# Altium project LED_Cube.PrjPcb
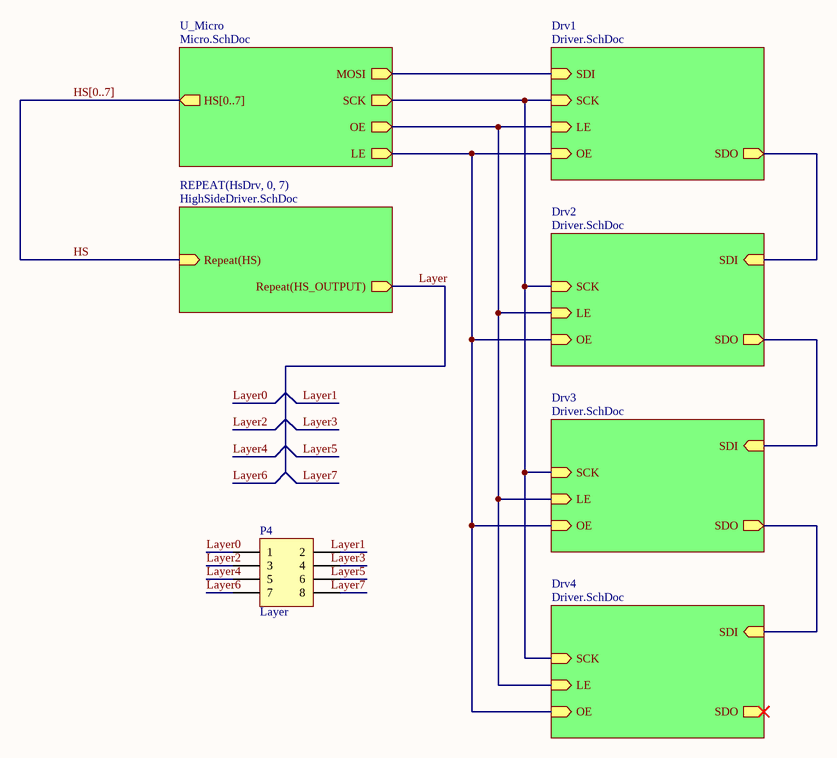
[diagram p0: Main.SchDoc]
4 sheets, 84 parts. Net scope: hierarchical (ports join the sheet entries above them; power ports are global).
Board file: LED_Cube.PcbDoc
Sheets:
  Main.SchDoc
    U_Micro = Micro.SchDoc
    Drv3 = Driver.SchDoc
    Drv2 = Driver.SchDoc
    Drv1 = Driver.SchDoc
    Drv4 = Driver.SchDoc
    HsDrv0 = HighSideDriver.SchDoc
    HsDrv1 = HighSideDriver.SchDoc
    HsDrv2 = HighSideDriver.SchDoc
    HsDrv3 = HighSideDriver.SchDoc
    HsDrv4 = HighSideDriver.SchDoc
    HsDrv5 = HighSideDriver.SchDoc
    HsDrv6 = HighSideDriver.SchDoc
    HsDrv7 = HighSideDriver.SchDoc

## Sheet Main.SchDoc
size A4

### Parts
(Parts that share a designator on the sheet are numbered #1, #2 ... from top to bottom, then left to right.)
P4#1  Layer  [HDR2X4H]

### Sub-sheets
Drv1 = Driver.SchDoc: SCK (in), SDI (in), SDO (out), LE (in), OE (in)
Drv2 = Driver.SchDoc: SCK (in), SDI (in), SDO (out), LE (in), OE (in)
Drv3 = Driver.SchDoc: SCK (in), SDI (in), SDO (out), LE (in), OE (in)
Drv4 = Driver.SchDoc: SCK (in), SDI (in), SDO (out), LE (in), OE (in)
REPEAT(HsDrv, 0, 7) = HighSideDriver.SchDoc: Repeat(HS_OUTPUT) (out), Repeat(HS) (in)
U_Micro = Micro.SchDoc: SCK (out), MOSI (out), OE (out), LE (out), HS[0..7] (out)

### Nets
Layer0: P4#1.1
Layer1: P4#1.2
Layer2: P4#1.3
Layer3: P4#1.4
Layer4: P4#1.5
Layer5: P4#1.6
Layer6: P4#1.7
Layer7: P4#1.8
NetU1#1_10: sheet U_Micro/LE, sheet Drv3/OE, sheet Drv2/OE, sheet Drv1/OE, sheet Drv4/OE
NetU1#1_11: sheet U_Micro/OE, sheet Drv3/LE, sheet Drv2/LE, sheet Drv1/LE, sheet Drv4/LE
NetU1#1_15: sheet U_Micro/SCK, sheet Drv3/SCK, sheet Drv2/SCK, sheet Drv1/SCK, sheet Drv4/SCK
NetU1#1_17: sheet U_Micro/MOSI, sheet Drv1/SDI
NetU1#2_22: sheet Drv2/SDI, sheet Drv1/SDO
NetU2#2_22: sheet Drv3/SDI, sheet Drv2/SDO
NetU3_22: sheet Drv3/SDO, sheet Drv4/SDI

### Buses and harness runs
bus HS[0..7] = sheet U_Micro/HS[0..7]

### Library data of the parts
P4#1 = Header 4X2H: Header, 4-Pin, Dual row, Right Angle; LatestRevisionDate: 17-Jul-2002; LatestRevisionNote: Re-released for DXP Platform.; Publisher: Altium Limited

## Sheet Micro.SchDoc
size A4
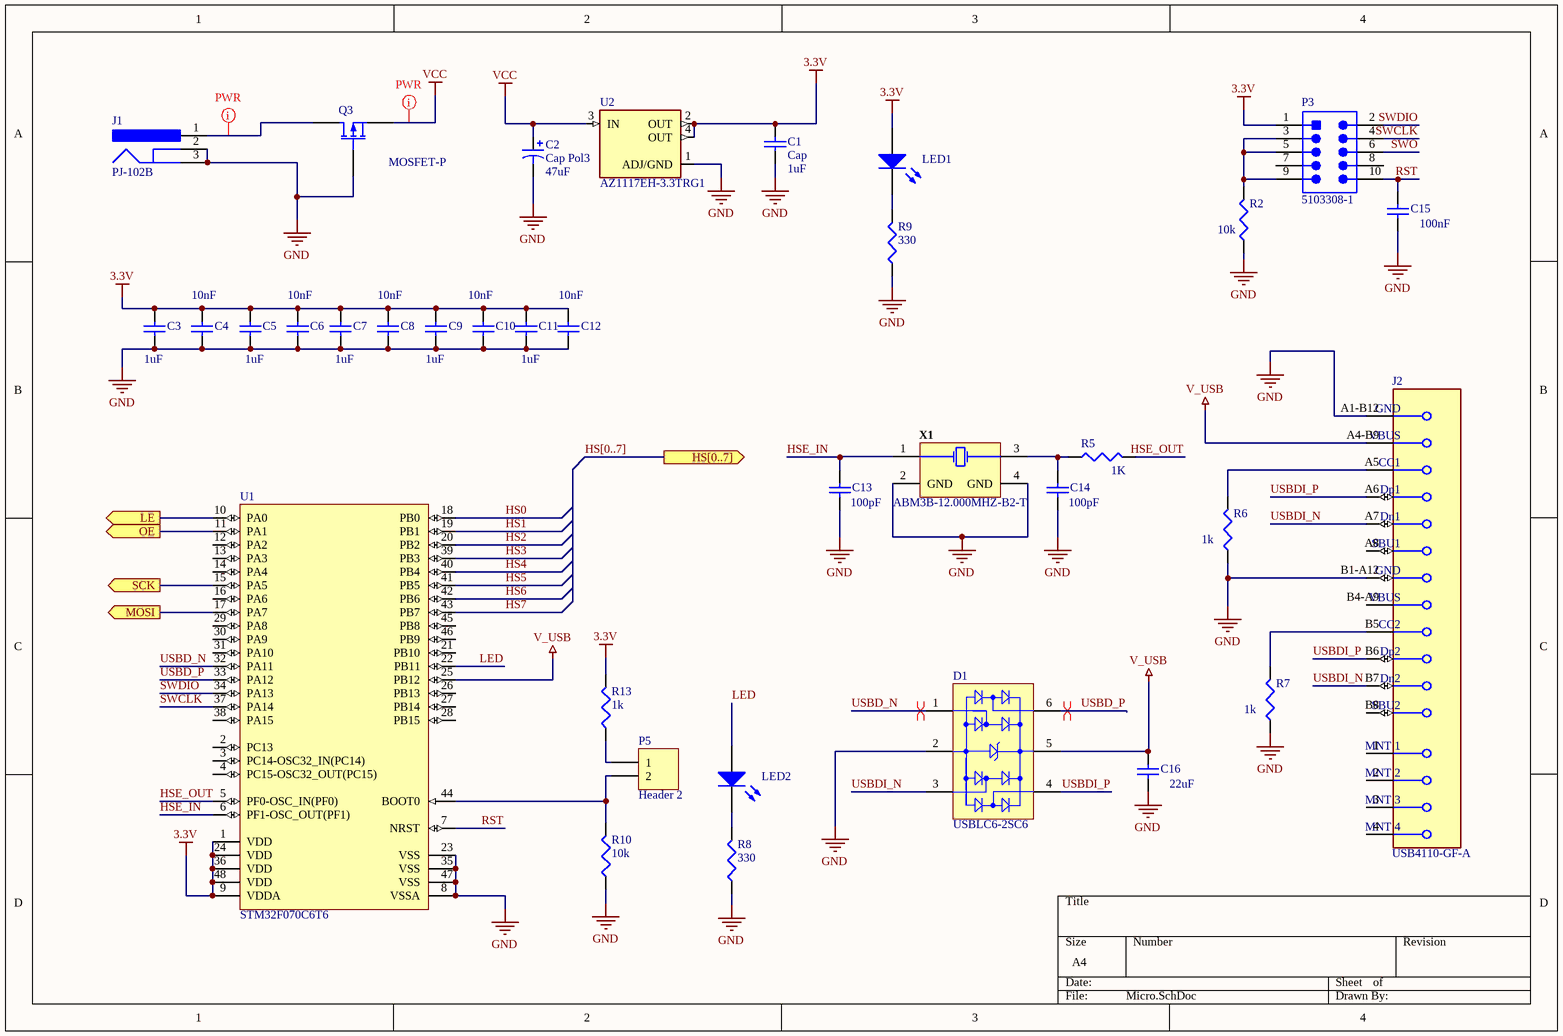
[diagram p1: Micro.SchDoc]

### Parts
(Parts that share a designator on the sheet are numbered #1, #2 ... from top to bottom, then left to right.)
C1  Cap  value 1uF  [1608[0603]]
C2  Cap Pol3  value 47uF  [2.5mmCap]
C3  value 1uF  [1608[0603]]  (hidden comment: Cap Semi)
C4  value 10nF  [1608[0603]]  (hidden comment: Cap Semi)
C5  value 1uF  [1608[0603]]  (hidden comment: Cap Semi)
C6  value 10nF  [1608[0603]]  (hidden comment: Cap Semi)
C7  value 1uF  [1608[0603]]  (hidden comment: Cap Semi)
C8  value 10nF  [1608[0603]]  (hidden comment: Cap Semi)
C9  value 1uF  [1608[0603]]  (hidden comment: Cap Semi)
C10  value 10nF  [1608[0603]]  (hidden comment: Cap Semi)
C11  value 1uF  [1608[0603]]  (hidden comment: Cap Semi)
C12  value 10nF  [1608[0603]]  (hidden comment: Cap Semi)
C13  value 100pF  [1608[0603]]  (hidden comment: Cap Semi)
C14  value 100pF  [1608[0603]]  (hidden comment: Cap Semi)
C15  value 100nF  [1608[0603]]  (hidden comment: Cap Semi)
C16  value 22uF  [1608[0603]]  (hidden comment: Cap Semi)
D1  USBLC6-2SC6  [STM-SOT23-6L_V]
J1  PJ-102B  [CUI-PJ-102B_V]
J2  USB4110-GF-A  [FP-USB4110-GF-A-MFG]
LED1  150120BS75000  [1206_A]  (value not drawn)
LED2  150120BS75000  [1206_A]  (value not drawn)
P3#1  5103308-1  [TECO-5103308-1_V]
P5#1  Header 2  [HDR1X2]
Q3#1  MOSFET-P  [SOT23_M]
R2#1  value 10k  [1608[0603]]  (hidden comment: Res3)
R5#1  value 1K  [1608[0603]]  (hidden comment: Res3)
R6#1  value 1k  [1608[0603]]  (hidden comment: Res3)
R7#1  value 1k  [1608[0603]]  (hidden comment: Res3)
R8#1  value 330  [1608[0603]]  (hidden comment: Res3)
R9#1  value 330  [1608[0603]]  (hidden comment: Res3)
R10#1  value 10k  [1608[0603]]  (hidden comment: Res3)
R13#1  value 1k  [1608[0603]]  (hidden comment: Res3)
U1#1  STM32F070C6T6  [STM-LQFP48_M]
U2#1  AZ1117EH-3.3TRG1  [SOT230P700X180-4N]
X1  ABM3B-12.000MHZ-B2-T  [*OSCCC320X250X60]

### Ports
HS[0..7] (out), LE (out), MOSI (out), OE (out), SCK (out)

### Nets
3.3V: C1.2 C3.2 C4.2 C5.2 C6.2 C7.2 C8.2 C9.2 C10.2 C11.2 C12.2 LED1.2(A) P3#1.1 R13#1.2 U1#1.1(VDD) U1#1.9(VDDA) U1#1.24(VDD) U1#1.36(VDD) U1#1.48(VDD) U2#1.2(OUT) U2#1.4(OUT)
GND: C1.1 C2.2 C3.1 C4.1 C5.1 C6.1 C7.1 C8.1 C9.1 C10.1 C11.1 C12.1 C13.1 C14.1 C15.1 C16.1 D1.2(GND) J1.2 J1.3 J2.A1-B12(GND) J2.B1-A12(GND) Q3#1.2(G) R2#1.1 R6#1.1 R7#1.1 R8#1.1 R9#1.1 R10#1.1 U1#1.8(VSSA) U1#1.23(VSS) U1#1.35(VSS) U1#1.47(VSS) U2#1.1(ADJ/GND) X1.2(GND) X1.4(GND)
V_USB: C16.2 D1.5(VBUS) J2.A4-B9(VBUS) U1#1.25(PB12)
VCC: C2.1 Q3#1.3(S) U2#1.3(IN)
HS0: U1#1.18(PB0)
HS1: U1#1.19(PB1)
HS2: U1#1.20(PB2)
HS3: U1#1.39(PB3)
HS4: U1#1.40(PB4)
HS5: U1#1.41(PB5)
HS6: U1#1.42(PB6)
HS7: U1#1.43(PB7)
HSE_IN: C13.2 U1#1.6(PF1-OSC_OUT(PF1)) X1.1(X1)
HSE_OUT: R5#1.2 U1#1.5(PF0-OSC_IN(PF0))
LED: LED2.2(A) U1#1.22(PB11)
RST: C15.2 P3#1.10 U1#1.7(NRST)
SWCLK: P3#1.4 U1#1.37(PA14)
SWDIO: P3#1.2 U1#1.34(PA13)
SWO: P3#1.6
USBD_N: D1.1(I/O_1) U1#1.32(PA11)
USBD_P: D1.6(I/O_4) U1#1.33(PA12)
USBDI_N: D1.3(I/O_2) J2.A7(Dn1) J2.B7(Dn2)
USBDI_P: D1.4(I/O_3) J2.A6(Dp1) J2.B6(Dp2)
NetC14_2: C14.2 R5#1.1 X1.3(X2)
NetJ1_1: J1.1 Q3#1.1(D)
NetJ2_A5: J2.A5(CC1) R6#1.2
NetJ2_B5: J2.B5(CC2) R7#1.2
NetLED1_1: LED1.1(K) R9#1.2
NetLED2_1: LED2.1(K) R8#1.2
NetP3#1_3: P3#1.3 P3#1.5 P3#1.9 R2#1.2
NetP5#1_1: P5#1.1 R13#1.1
NetP5#1_2: P5#1.2 R10#1.2 U1#1.44(BOOT0)
NetU1#1_10: U1#1.10(PA0) ; port LE
NetU1#1_11: U1#1.11(PA1) ; port OE
NetU1#1_15: U1#1.15(PA5) ; port SCK
NetU1#1_17: U1#1.17(PA7) ; port MOSI

Not connected (* = marked no-connect by the designer): J2 1(MNT_1) 2(MNT_2) 3(MNT_3) 4(MNT_4) A8(SBU1) B4-A9(VBUS) B8(SBU2); P3#1 7 8; U1#1 2(PC13) 3(PC14-OSC32_IN(PC14)) 4(PC15-OSC32_OUT(PC15)) 12(PA2) 13(PA3) 14(PA4) 16(PA6) 21(PB10) 26(PB13) 27(PB14) 28(PB15) 29(PA8) 30(PA9) 31(PA10) 38(PA15) 45(PB8) 46(PB9)

### Buses and harness runs
bus HS[0..7] = port HS[0..7]

### Layout directives
rule Width Constraint [Pref Width = 40mil    Min Width = 17mil    Max Width = 59.055mil]: NetJ1_1, VCC
differential pair; rule Differential Pairs Routing [Pref Gap = 10mil    Min Gap  = 4mil    Max Gap  = 10milPref Width = 15mil    Min Width  = 6mil    Max Width  = 15mil]: USBD_N, USBD_P

### Library data of the parts
C1 = Cap: Capacitor; Published: 8-Jun-2000; LatestRevisionDate: 17-Jul-2002; LatestRevisionNote: Re-released for DXP Platform.; PackageReference: RAD-0.3; Publisher: Altium Limited; PackageDescription: Radial Cap, Thru-Hole; 2 Leads; 0.3 in Pin Spacing
C2 = Cap Pol3: Polarized Capacitor (Surface Mount); Published: 8-Jun-2000; LatestRevisionDate: 29-May-2009; LatestRevisionNote: IPC-7351 Footprint Added.; PackageReference: C0805; Publisher: Altium Limited; PackageDescription: Chip Capacitor
C3 C5 C7 C9 C11 = Cap Semi_1: Capacitor (Semiconductor SIM Model); Published: 8-Jun-2000; LatestRevisionDate: 29-May-2009; LatestRevisionNote: IPC-7351 Footprint Added.; PackageReference: C1206; Publisher: Altium Limited; PackageDescription: Chip Capacitor; LCSC Part #: C15849
C4 C6 C8 C10 C12 = Cap Semi_2: Capacitor (Semiconductor SIM Model); Published: 8-Jun-2000; LatestRevisionDate: 29-May-2009; LatestRevisionNote: IPC-7351 Footprint Added.; PackageReference: C1206; Publisher: Altium Limited; PackageDescription: Chip Capacitor; LCSC Part #: C15195
C13 C14 = Cap Semi: Capacitor (Semiconductor SIM Model); Published: 8-Jun-2000; LatestRevisionDate: 29-May-2009; LatestRevisionNote: IPC-7351 Footprint Added.; PackageReference: C1206; Publisher: Altium Limited; PackageDescription: Chip Capacitor
C15 C16 = Cap Semi_3: Capacitor (Semiconductor SIM Model); Published: 8-Jun-2000; LatestRevisionDate: 29-May-2009; LatestRevisionNote: IPC-7351 Footprint Added.; PackageReference: C1206; Publisher: Altium Limited; PackageDescription: Chip Capacitor; LCSC Part #: C14663
D1 = CMP-2000-05378-1: Very low capacitance ESD protection, 3.5 pF, -40 to 125 degC, 6-Pin SOT23, RoHS, Tape and Reel; Manufacturer: STMicroelectronics; Polarity: Uni-Directional; Clamping Voltage: 17V; Rad Hardened: No; Product Height (mm): 1.3mm; Leakage Current (Max): 0.15uA; Product Length (mm): 3.05mm; Number of Elements: 1; Peak Pulse Current: 5A; Configuration: Dual; Reverse Breakdown Voltage: 6V; Working Voltage (Max): 5V; Capacitance Value: 3.5pF; Suppressor Type: DiodeArrays; Product Depth (mm): 1.75mm; Test Current (It): 1mA; Package / Case: SOT-23; Operating Temperature Max Deg. C: 125C; Package Description: 6-Pin Small Outline Transistor, Body 2.925 x 1.625 mm, Pitch 0.95 mm; Package Reference: SOT23-6L; Datasheet Version: Rev. 5, 10/2011; Operating Temperature Min Deg. C: -40C; Mounting Style: SurfaceMount; Direction Type: Uni-Directional; Mounting: SurfaceMount; Pin Count: 6; Leakage Current: 0.15uA; Packaging: TapeandReel; Operating Temperature Classification: Automotive; Clamping Voltage (Max): 17V; Manufacturer URL: http://www.st.com/; Reverse Stand-off Voltage: 5V; Datasheet URL: http://www.st.com/st-web-ui/static/active/en/resource/technical/document/datasheet/CD00050750.pdf; Working Voltage: 5V; Operating Temp Range: -40Cto125C
J1 = CMP-2000-06900-1: Through Hole Right Angle DC Power Jack, 2.5 A, 2.5 mm Center Pin, 3 Position, -25 to 85 degC, RoHS, Bulk; Manufacturer: CUIInc.; Insulation Resistance: 100MOhms; Inside Contact Diameter: 2.5mm; Outside Contact Diameter: 6.5mm; Voltage Rating: 24V; Current Rating: 2.5A; Brand: CUI; Datasheet URL: http://www.cui.com/product/resource/pj-102b.pdf; Housing Material: PolybutyleneTerephthalate(PBT); Operating Temperature Range: -25Cto+85C; Package Reference: PJ-102B; Factory Pack Quantity: 280; RoHS: True; Contact Material: Copper; Datasheet Version: Rev. 1.03, 04/2016; Product: Jacks; Mounting Angle: Right; Mounting Style: ThroughHole; Flammability Rating: UL94V-0; Product Category: DCPowerConnectors; Contact Gender: Male; Termination Style: ThroughHole; Manufacturer URL: http://www.cui.com/; Mounting Technology: ThroughHole; Package Description: 3-Pin Through Hole Device, Body 14.4 x 9 mm, Height 11 mm; Contact Plating: Nickel; Packaging: Bulk; Connector Type: DCPowerJack
J2 = CMP-245163-000002-1: CONN USB 2.0 TYPE-C R/A SMT; Manufacturer: GCT; Conn Orientation: Right Angle; Usb Standard: USB 2.0; Voltage Rating: 20V; Current Rating: 3/4.25/1.25/0.25A; Number Of Contacts: 16; Is Female: yes; Shielding: true; Standoff Height: 0.1mm; Octopart: https://octopart.com/usb4110-gf-a-gct-103941985; Temperature: -40°C to +85°C; RoHS: TRUE; Automotive: No; Contact Material: Gold,Nickel; Device Class L1: Connectors; Device Class L2: USB Connectors; Package: 0; Lead Free: Yes; ComponentLink2URL: https://gct.co/files/drawings/usb4110.pdf; Temperature Range High: +85°C; Temperature Range Low: -40°C; Height: 3.46mm; Manufacturer Part Number: USB4110-GF-A; ComponentLink2Description: Datasheet; Device Class L3: unset; Digikey Description: CONN USB 2.0 TYPE-C R/A SMT; Category: Conn
LED1 LED2 = CMP-1426-00015-1: SMD mono-color Chip LED, WL-SMCW, Blue; Manufacturer: Wuerth Elektronik; ComponentLink2Description: Datasheet; ComponentLink1URL: http://www.we-online.com; PartNumber: 150120BS75000; ComponentLink1Description: Manufacturer URL; ComponentLink2URL: http://katalog.we-online.com/led/datasheet/150120BS75000.pdf; PackageReference: 1206_A; Color: Blue
P3#1 = CMP-2000-05416-1: Male Header, Pitch 2.54 mm, 2 x 5 Position, Height 9.85 mm, Tail Length 3.05 mm, RoHS, Tube; Manufacturer: TE Connectivity; Pitch: 0.100"(2.54mm); Mating Products: 1658624-1-ND / -CONNRCPT10POSPOLARGOLD / 1658527-4-ND / -CONNRCPT10POS.100W/STRRELF / 1658527-3-ND / -CONNRCPT10POS.100622SERIES / 1658526-3-ND / -CONNRCPT10POSVERTGOLD / 1658526-5-ND / -609-1041LFFEMSOCKT,LEADFREE / 1658526-4-ND / -609-1030LFFEMSOCKT,LEADFREE / ASC10B-ND / -CONNIDCSOCKET10POSGOLD / ASC10H-ND / -CONNIDCSOCKET10POS15GOLD / AKC10B-ND / -CONNIDCSKT10POSW/POLGOLD / AKC10H-ND / -CONNIDCSKT10POSW/POL15GOLD / More...; Dynamic Catalog: AMP-LatchSeries; Number of Positions Loaded: All; Featured Product: AMP-LATCHRibbonCableConnectors; 3D Model: 5103308-1.pdf; Number of Positions: 10; Other Names: A33159; Catalog Drawings: LowProfileShroudedStraight; Connector Type: Header,Shrouded; Termination: Solder; Contact Finish Thickness: 15µin(0.38µm); Datasheet URL: http://www.onlinecomponents.com/productFiles/mf-AMP/eng_cat_889409_0699_96_.pdf; Standard Package: 125; Number of Rows: 2; Contact Type: MalePin; Mounting Type: ThroughHole; Manufacturer URL: http://www.te.com/; Contact Finish: GoldorGold-Palladium; Family: RectangularConnectors-Headers,MalePins; RoHS Information: 5103308-1StatementofCompliance; Packaging: Tube; Category: Connectors,Interconnects; Datasheet Version: Apr-12; Contact Mating Length: 0.240"(6.10mm); Series: AMP-Latch; Row Spacing: 0.100"(2.54mm); Color: Black
P5#1 = Header 2: Header, 2-Pin; LatestRevisionDate: 17-Jul-2002; LatestRevisionNote: Re-released for DXP Platform.; Publisher: Altium Limited
Q3#1 = MOSFET-P: P-Channel MOSFET; pin to pad: 2>3 3>2; Published: 8-Jun-2000; LatestRevisionDate: 17-Jul-2002; LatestRevisionNote: Re-released for DXP Platform.; PackageVersion: 1995/1996; PackageReference: E3; Publisher: Altium Limited; PackageDescription: TO, Flat Index; 3 In-Line, Axial Leads; Body Dia. 4.6mm; Lead Dia. 0.5 mm (max)
R2#1 R6#1 R7#1 R8#1 R9#1 R10#1 R13#1 = Res3_2: Resistor; Published: 8-Jun-2000; LatestRevisionDate: 29-May-2009; LatestRevisionNote: IPC-7351 Footprint Added.; PackageReference: J1-0603; Publisher: Altium Limited; PackageDescription: Chip Resistor; LCSC Part #: C25804
R5#1 = Res3: Resistor; Published: 8-Jun-2000; LatestRevisionDate: 29-May-2009; LatestRevisionNote: IPC-7351 Footprint Added.; PackageReference: J1-0603; Publisher: Altium Limited; PackageDescription: Chip Resistor
U1#1 = CMP-0304-00142-2: ARM Cortex-M0 32-bit MCU, 32 KB Flash, 6 KB Internal RAM, 37 I/Os, 48-Pin LQFP, -40 to 85 degC, Tray; Manufacturer: STMicroelectronics; Supply Voltage(Vcc) min (V): 2.4; I/Os (High Current): 37; Internal RAM Size (kB): 6; FLASH Size (Prog) (kB): 32; Operating Frequency(F) (Processor speed) (MHz): 48; ComponentLink2URL: http://www.st.com/st-web-ui/static/active/en/resource/technical/document/datasheet/DM00141386.pdf; Core: ARM Cortex-M0; Mounting Technology: Surface Mount; ComponentLink2Description: Datasheet; ComponentLink1Description: Manufacturer URL; Package Reference: LQFP48; DatasheetVersion: Rev. 3; ComponentLink1URL: http://www.st.com/; PartNumber: STM32F070C6T6; Package Description: 48-Pin Low Profile Quad Flat Package, Body 7 x 7 mm, Pitch 0.5 mm; Packing: Tray
U2#1 = AZ1117EH-3.3TRG1: Linear Voltage Regulator IC 1 Output 1A SOT-223; MF: Diodes Inc.; Package: SOT-223 Diodes Inc.; Value: *; Price: None; MP: AZ1117EH-3.3TRG1; SnapEDA_Link: https://www.snapeda.com/parts/AZ1117EH-3.3TRG1/Diodes%20Inc./view-part/482930/?ref=snap; Availability: Unavailable
X1 = CMP-003-00015-1: Ceramic SMD Crystal, 12 MHz, +/- 20 ppm, 18 pF, -20 to 70 degC, 4-Pin SMD, RoHS, Tape and Reel; Manufacturer: Abracon; Tolerance: 20ppm; ESR: 70; Resistance: 70Ohm; Frequency: 12MHz; Load Capacitance: 18pF; Case/Package: CSMD; Max Operating Temperature: 70°C; Datasheet URL: http://www.abracon.com/Resonators/abm3b.pdf; Pins: 4; RoHS Compliant: True; Package Quantity: 1000; Package Reference: ABM3B; Frequency Tolerance: 20ppm; Datasheet Version: Aug-15; Mounting Technology: SM; Packaging: TapeandReel; Manufacturer URL: http://www.abracon.com/; Min Operating Temperature: -20°C; Package Description: 4-Pin Surface Mount Device, Body 5 x 3.2 mm; LCSC Part #: C9006; Manufacturer Part Number: ABM3B-12.000MHZ-B2-T; Component Type: Crystals & Oscillators

## Sheet Driver.SchDoc
size A4
Used 4 times, as channels Drv3, Drv2, Drv1, Drv4. Parts and nets are listed once, with the designators drawn on the sheet.
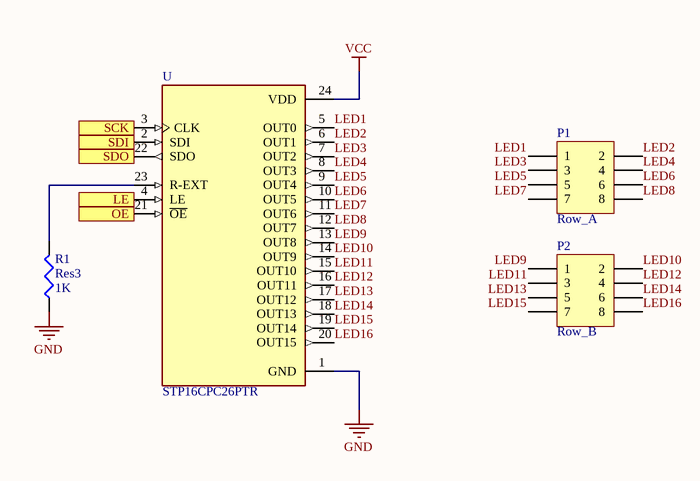
[diagram p2: Driver.SchDoc]

### Parts
P1  Row_A  [HDR2X4H]
P2  Row_B  [HDR2X4H]
R1  Res3  value 1K  [1608[0603]]
U  STP16CPC26PTR  [TSOP65P700X110_HS-25N]

### Ports
LE (in), OE (in), SCK (in), SDI (in), SDO (out)

### Nets
GND: R1.1 U.1(GND)
VCC: U.24(VDD)
LE: U.4(LE) ; port LE
LED1: P1.1 U.5(OUT0)
LED2: P1.2 U.6(OUT1)
LED3: P1.3 U.7(OUT2)
LED4: P1.4 U.8(OUT3)
LED5: P1.5 U.9(OUT4)
LED6: P1.6 U.10(OUT5)
LED7: P1.7 U.11(OUT6)
LED8: P1.8 U.12(OUT7)
LED9: P2.1 U.13(OUT8)
LED10: P2.2 U.14(OUT9)
LED11: P2.3 U.15(OUT10)
LED12: P2.4 U.16(OUT11)
LED13: P2.5 U.17(OUT12)
LED14: P2.6 U.18(OUT13)
LED15: P2.7 U.19(OUT14)
LED16: P2.8 U.20(OUT15)
OE: U.21(~{OE}) ; port OE
SCK: U.3(CLK) ; port SCK
SDI: U.2(SDI) ; port SDI
SDO: U.22(SDO) ; port SDO
NetR1_2: R1.2 U.23(R-EXT)

### Channels
Drv3: designators P1=P5#2 P2=P6 R1=R3 U=U3; ports LE=NetU1#1_11 OE=NetU1#1_10 SCK=NetU1#1_15 SDI=NetU2#2_22 SDO=NetU3_22
Drv2: designators P1=P3#2 P2=P4#2 R1=R2#2 U=U2#2; ports LE=NetU1#1_11 OE=NetU1#1_10 SCK=NetU1#1_15 SDI=NetU1#2_22 SDO=NetU2#2_22
Drv1: designators P1=P1 P2=P2 R1=R1 U=U1#2; ports LE=NetU1#1_11 OE=NetU1#1_10 SCK=NetU1#1_15 SDI=NetU1#1_17 SDO=NetU1#2_22
Drv4: designators P1=P7 P2=P8 R1=R4 U=U4; ports LE=NetU1#1_11 OE=NetU1#1_10 SCK=NetU1#1_15 SDI=NetU3_22 SDO=NetU4_22

### Library data of the parts
P1 P2 = Header 4X2H: Header, 4-Pin, Dual row, Right Angle; LatestRevisionDate: 17-Jul-2002; LatestRevisionNote: Re-released for DXP Platform.; Publisher: Altium Limited
R1 = Res3: Resistor; Published: 8-Jun-2000; LatestRevisionDate: 29-May-2009; LatestRevisionNote: IPC-7351 Footprint Added.; PackageReference: J1-0603; Publisher: Altium Limited; PackageDescription: Chip Resistor
U = STP16CPC26PTR: LED Driver IC 16 Output Linear Shift Register Analog Dimming 90mA 24-QSOP; MF: STMicroelectronics; Package: QSOP-24 STMicroelectronics; Value: *; MP: STP16CPC26PTR; Availability: Unavailable; SnapEDA_Link: https://www.snapeda.com/parts/STP16CPC26PTR/STMicroelectronics/view-part/314081/?ref=snap; Price: None

## Sheet HighSideDriver.SchDoc
size A4
Used 8 times, as channels HsDrv0, HsDrv1, HsDrv2, HsDrv3, HsDrv4, HsDrv5, HsDrv6, HsDrv7. Parts and nets are listed once, with the designators drawn on the sheet.
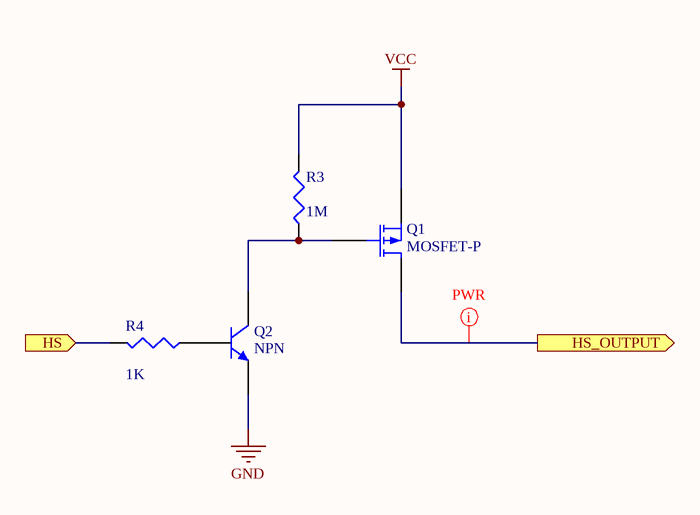
[diagram p3: HighSideDriver.SchDoc]

### Parts
Q1  MOSFET-P  [SOT23_M]
Q2  NPN  [SOT-23B_M]
R3  value 1M  [1608[0603]]  (hidden comment: Res3)
R4  value 1K  [1608[0603]]  (hidden comment: Res3)

### Ports
HS (in), HS_OUTPUT (out)

### Nets
GND: Q2.3(E)
VCC: Q1.3(S) R3.2
HS: R4.2 ; port HS
HS_OUTPUT: Q1.1(D) ; port HS_OUTPUT
NetQ1_2: Q1.2(G) Q2.1(C) R3.1
NetQ2_2: Q2.2(B) R4.1

### Channels
HsDrv0: designators Q1=Q15 Q2=Q16 R3=R19 R4=R20; ports HS=HS0 HS_OUTPUT=Layer0
HsDrv1: designators Q1=Q1 Q2=Q2 R3=R5#2 R4=R6#2; ports HS=HS1 HS_OUTPUT=Layer1
HsDrv2: designators Q1=Q3#2 Q2=Q4 R3=R7#2 R4=R8#2; ports HS=HS2 HS_OUTPUT=Layer2
HsDrv3: designators Q1=Q5 Q2=Q6 R3=R9#2 R4=R10#2; ports HS=HS3 HS_OUTPUT=Layer3
HsDrv4: designators Q1=Q7 Q2=Q8 R3=R11 R4=R12; ports HS=HS4 HS_OUTPUT=Layer4
HsDrv5: designators Q1=Q9 Q2=Q10 R3=R13#2 R4=R14; ports HS=HS5 HS_OUTPUT=Layer5
HsDrv6: designators Q1=Q11 Q2=Q12 R3=R15 R4=R16; ports HS=HS6 HS_OUTPUT=Layer6
HsDrv7: designators Q1=Q13 Q2=Q14 R3=R17 R4=R18; ports HS=HS7 HS_OUTPUT=Layer7

### Layout directives
rule Width Constraint [Pref Width = 1mm    Min Width = 0.381mm    Max Width = 1mm]: Layer0

### Library data of the parts
Q1 = MOSFET-P: P-Channel MOSFET; pin to pad: 2>3 3>2; Published: 8-Jun-2000; LatestRevisionDate: 17-Jul-2002; LatestRevisionNote: Re-released for DXP Platform.; PackageVersion: 1995/1996; PackageReference: E3; Publisher: Altium Limited; PackageDescription: TO, Flat Index; 3 In-Line, Axial Leads; Body Dia. 4.6mm; Lead Dia. 0.5 mm (max)
Q2 = NPN: NPN Bipolar Transistor; pin to pad: 1>3 2>1 3>2; Published: 8-Jun-2000; LatestRevisionDate: 17-Jul-2002; LatestRevisionNote: Re-released for DXP Platform.; PackageReference: TO-226-AA; Publisher: Altium Limited; PackageDescription: TO, Flat Index; 3 In-Line, Axial Leads; Body Dia. 4.8mm; Leads 0.55 x 0.51 mm (max); Code_JEDEC: TO-226-AA
R3 R4 = Res3: Resistor; Published: 8-Jun-2000; LatestRevisionDate: 29-May-2009; LatestRevisionNote: IPC-7351 Footprint Added.; PackageReference: J1-0603; Publisher: Altium Limited; PackageDescription: Chip Resistor

## Nets that join several sheets
GND: Micro (35 pins), Drv3 (R3.1 U3.1), Drv2 (R2#2.1 U2#2.1), Drv1 (R1.1 U1#2.1), Drv4 (R4.1 U4.1), HsDrv0 (Q16.3), HsDrv1 (Q2.3), HsDrv2 (Q4.3), HsDrv3 (Q6.3), HsDrv4 (Q8.3), HsDrv5 (Q10.3), HsDrv6 (Q12.3), HsDrv7 (Q14.3)
VCC: Micro (C2.1 Q3#1.3 U2#1.3), Drv3 (U3.24), Drv2 (U2#2.24), Drv1 (U1#2.24), Drv4 (U4.24), HsDrv0 (Q15.3 R19.2), HsDrv1 (Q1.3 R5#2.2), HsDrv2 (Q3#2.3 R7#2.2), HsDrv3 (Q5.3 R9#2.2), HsDrv4 (Q7.3 R11.2), HsDrv5 (Q9.3 R13#2.2), HsDrv6 (Q11.3 R15.2), HsDrv7 (Q13.3 R17.2)
HS0: Micro (U1#1.18), HsDrv0 (R20.2)
HS1: Micro (U1#1.19), HsDrv1 (R6#2.2)
HS2: Micro (U1#1.20), HsDrv2 (R8#2.2)
HS3: Micro (U1#1.39), HsDrv3 (R10#2.2)
HS4: Micro (U1#1.40), HsDrv4 (R12.2)
HS5: Micro (U1#1.41), HsDrv5 (R14.2)
HS6: Micro (U1#1.42), HsDrv6 (R16.2)
HS7: Micro (U1#1.43), HsDrv7 (R18.2)
Layer0: Main (P4#1.1), HsDrv0 (Q15.1)
Layer1: Main (P4#1.2), HsDrv1 (Q1.1)
Layer2: Main (P4#1.3), HsDrv2 (Q3#2.1)
Layer3: Main (P4#1.4), HsDrv3 (Q5.1)
Layer4: Main (P4#1.5), HsDrv4 (Q7.1)
Layer5: Main (P4#1.6), HsDrv5 (Q9.1)
Layer6: Main (P4#1.7), HsDrv6 (Q11.1)
Layer7: Main (P4#1.8), HsDrv7 (Q13.1)
NetU1#1_10: Micro (U1#1.10), Drv3 (U3.21), Drv2 (U2#2.21), Drv1 (U1#2.21), Drv4 (U4.21)
NetU1#1_11: Micro (U1#1.11), Drv3 (U3.4), Drv2 (U2#2.4), Drv1 (U1#2.4), Drv4 (U4.4)
NetU1#1_15: Micro (U1#1.15), Drv3 (U3.3), Drv2 (U2#2.3), Drv1 (U1#2.3), Drv4 (U4.3)
NetU1#1_17: Micro (U1#1.17), Drv1 (U1#2.2)
NetU1#2_22: Drv2 (U2#2.2), Drv1 (U1#2.22)
NetU2#2_22: Drv3 (U3.2), Drv2 (U2#2.22)
NetU3_22: Drv3 (U3.22), Drv4 (U4.2)